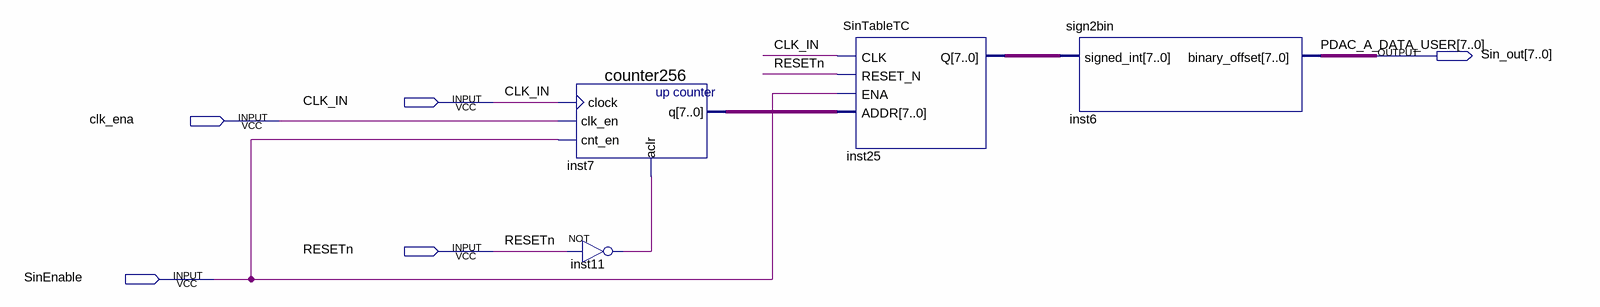
[diagram p0: schematic sheet]
// Quartus schematic FREQ2SIN.bdf as structural Verilog: 4 symbols, 5 pins
module FREQ2SIN (
  input  CLK_IN,
  input  clk_ena,
  input  RESETn,
  input  SinEnable,
  output [7:0] Sin_out
);

  wire inst11_out;
  wire [7:0] inst7_q, inst25_q;

  counter256 inst7 (.clock(CLK_IN), .clk_en(clk_ena), .cnt_en(SinEnable), .aclr(inst11_out), .q(inst7_q));
  not inst11 (inst11_out, RESETn);
  SinTableTC inst25 (.CLK(CLK_IN), .RESET_N(RESETn), .ENA(SinEnable), .ADDR(inst7_q), .Q(inst25_q));
  sign2bin inst6 (.signed_int(inst25_q), .binary_offset(Sin_out));

  // Other names for the same wires on the sheet: PDAC_A_DATA_USER[7:0] = Sin_out
endmodule
